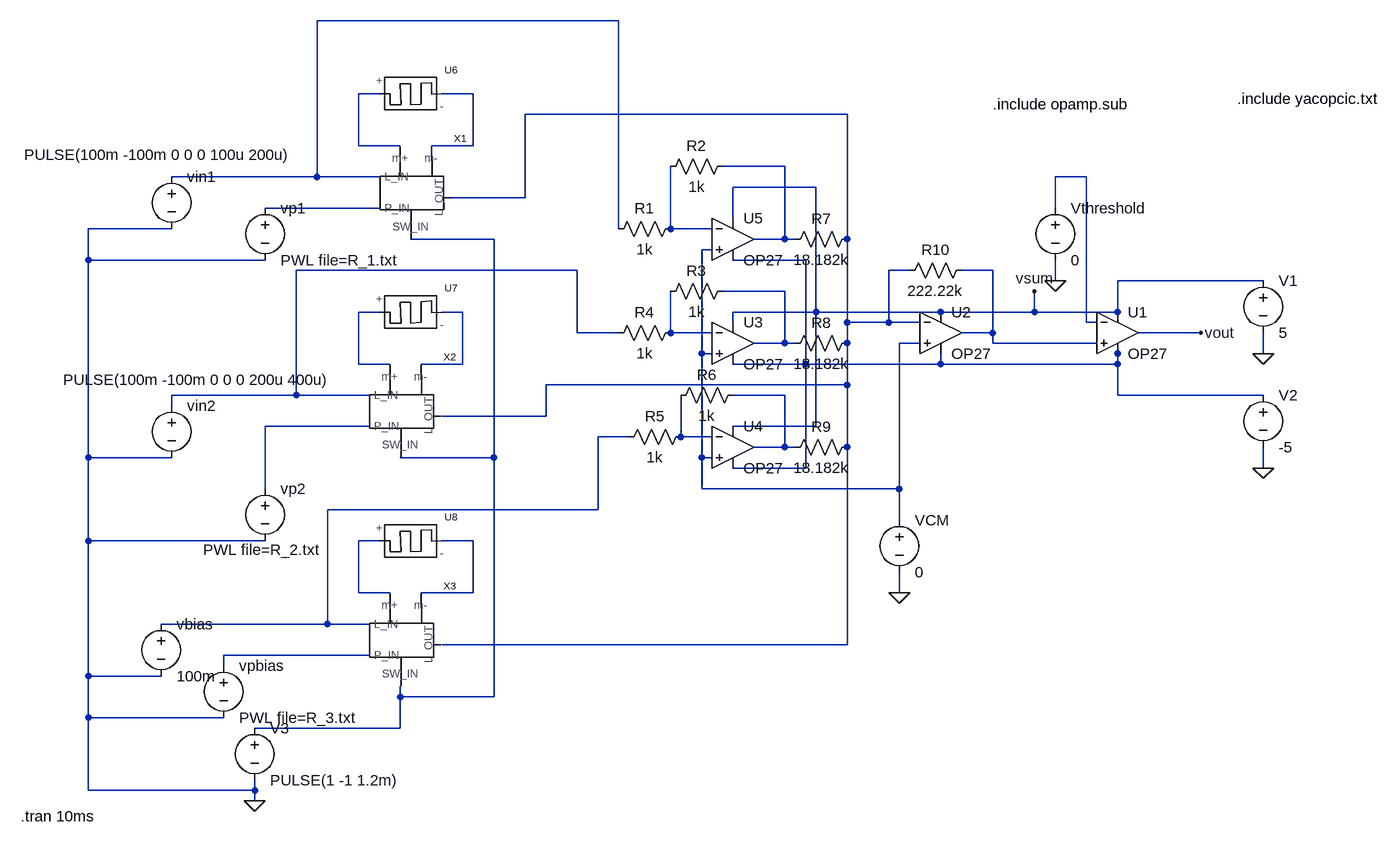
[diagram p0: schematic ADALINE.asc]
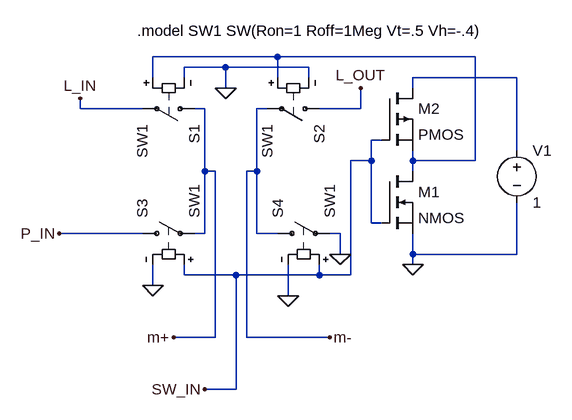
[diagram p1: sub-circuit switchboxsymbol.asc]
ADALINE.asc, the LTspice schematic file:
Version 4
SHEET 1 1164 968
WIRE -80 -272 -544 -272
WIRE -448 -160 -480 -160
WIRE -304 -160 -352 -160
WIRE 272 -128 -224 -128
WIRE -480 -80 -480 -160
WIRE -416 -80 -480 -80
WIRE -304 -80 -304 -160
WIRE -304 -80 -368 -80
WIRE 176 -48 80 -48
WIRE -544 -32 -544 -272
WIRE -544 -32 -768 -32
WIRE -448 -32 -544 -32
WIRE 640 -32 592 -32
WIRE 224 -16 96 -16
WIRE -224 0 -224 -128
WIRE -224 0 -336 0
WIRE -448 16 -624 16
WIRE 592 16 592 -32
WIRE 96 32 96 -16
WIRE -768 48 -896 48
WIRE -80 48 -80 -272
WIRE 0 48 0 -48
WIRE 64 48 0 48
WIRE -272 64 -400 64
WIRE 176 64 176 -48
WIRE 176 64 128 64
WIRE 192 64 176 64
WIRE 272 64 272 -128
WIRE 64 80 48 80
WIRE -896 96 -896 48
WIRE -624 96 -896 96
WIRE 208 96 96 96
WIRE -144 112 -576 112
WIRE 368 112 336 112
WIRE 496 112 448 112
WIRE 592 128 592 96
WIRE 912 128 688 128
WIRE 176 144 80 144
WIRE -448 176 -480 176
WIRE -320 176 -352 176
WIRE 224 176 224 -16
WIRE 224 176 96 176
WIRE 416 176 224 176
WIRE 560 176 560 144
WIRE 560 176 416 176
WIRE 688 176 688 128
WIRE 688 176 560 176
WIRE 96 192 96 176
WIRE 272 192 272 64
WIRE 336 192 336 112
WIRE 336 192 272 192
WIRE 384 192 336 192
WIRE 640 192 640 -32
WIRE 656 192 640 192
WIRE -144 208 -144 112
WIRE -80 208 -144 208
WIRE 0 208 0 144
WIRE 64 208 0 208
WIRE 496 208 496 112
WIRE 496 208 448 208
WIRE 816 208 720 208
WIRE 176 224 176 144
WIRE 176 224 128 224
WIRE 192 224 176 224
WIRE 272 224 272 192
WIRE 384 224 352 224
WIRE 496 224 496 208
WIRE 656 224 496 224
WIRE 48 240 48 80
WIRE 64 240 48 240
WIRE 688 240 688 224
WIRE 912 240 912 208
WIRE -480 256 -480 176
WIRE -432 256 -480 256
WIRE -320 256 -320 176
WIRE -320 256 -384 256
WIRE 208 256 208 96
WIRE 208 256 96 256
WIRE 416 256 416 240
WIRE 416 256 208 256
WIRE 688 256 688 240
WIRE 688 256 416 256
WIRE 272 288 272 224
WIRE 272 288 -192 288
WIRE -576 304 -576 112
WIRE -576 304 -768 304
WIRE -464 304 -576 304
WIRE 176 304 96 304
WIRE 688 304 688 256
WIRE 912 304 688 304
WIRE -768 320 -768 304
WIRE -192 336 -192 288
WIRE -192 336 -352 336
WIRE -464 352 -624 352
WIRE 224 352 224 176
WIRE 224 352 96 352
WIRE -64 368 -112 368
WIRE 16 368 16 304
WIRE 64 368 16 368
WIRE 176 384 176 304
WIRE 176 384 128 384
WIRE 192 384 176 384
WIRE 272 384 272 288
WIRE -896 400 -896 96
WIRE -768 400 -896 400
WIRE -272 400 -272 64
WIRE -272 400 -416 400
WIRE 48 400 48 240
WIRE 64 400 48 400
WIRE 208 416 208 256
WIRE 208 416 96 416
WIRE 912 416 912 384
WIRE -624 448 -624 352
WIRE 48 448 48 400
WIRE 352 448 352 224
WIRE 352 448 48 448
WIRE -112 480 -112 368
WIRE -112 480 -528 480
WIRE 352 496 352 448
WIRE -896 528 -896 400
WIRE -624 528 -896 528
WIRE -448 528 -480 528
WIRE -304 528 -352 528
WIRE -480 608 -480 528
WIRE -432 608 -480 608
WIRE -304 608 -304 528
WIRE -304 608 -384 608
WIRE 352 608 352 576
WIRE -528 656 -528 480
WIRE -528 656 -784 656
WIRE -464 656 -528 656
WIRE 272 688 272 384
WIRE 272 688 -352 688
WIRE -464 704 -688 704
WIRE -688 720 -688 704
WIRE -896 736 -896 528
WIRE -784 736 -896 736
WIRE -416 768 -416 752
WIRE -272 768 -272 400
WIRE -272 768 -416 768
WIRE -896 800 -896 736
WIRE -688 800 -896 800
WIRE -416 816 -416 768
WIRE -416 816 -640 816
WIRE -896 912 -896 800
WIRE -640 912 -640 896
WIRE -640 912 -896 912
WIRE -640 928 -640 912
FLAG 912 416 0
FLAG 912 240 0
FLAG 352 608 0
FLAG -640 928 0
FLAG 816 208 vout
FLAG 560 144 vsum
FLAG 592 128 0
SYMBOL res 16 32 R90
WINDOW 0 0 56 VBottom 2
WINDOW 3 32 56 VTop 2
SYMATTR InstName R1
SYMATTR Value 1k
SYMBOL res 96 -64 R90
WINDOW 0 0 56 VBottom 2
WINDOW 3 32 56 VTop 2
SYMATTR InstName R2
SYMATTR Value 1k
SYMBOL res 96 128 R90
WINDOW 0 0 56 VBottom 2
WINDOW 3 32 56 VTop 2
SYMATTR InstName R3
SYMATTR Value 1k
SYMBOL res 16 192 R90
WINDOW 0 0 56 VBottom 2
WINDOW 3 32 56 VTop 2
SYMATTR InstName R4
SYMATTR Value 1k
SYMBOL res 32 352 R90
WINDOW 0 0 56 VBottom 2
WINDOW 3 32 56 VTop 2
SYMATTR InstName R5
SYMATTR Value 1k
SYMBOL res 112 288 R90
WINDOW 0 0 56 VBottom 2
WINDOW 3 32 56 VTop 2
SYMATTR InstName R6
SYMATTR Value 1k
SYMBOL res 288 48 R90
WINDOW 0 0 56 VBottom 2
WINDOW 3 32 56 VTop 2
SYMATTR InstName R7
SYMATTR Value 18.182k
SYMBOL res 288 208 R90
WINDOW 0 0 56 VBottom 2
WINDOW 3 32 56 VTop 2
SYMATTR InstName R8
SYMATTR Value 18.182k
SYMBOL res 288 368 R90
WINDOW 0 0 56 VBottom 2
WINDOW 3 32 56 VTop 2
SYMATTR InstName R9
SYMATTR Value 18.182k
SYMBOL res 464 96 R90
WINDOW 0 0 56 VBottom 2
WINDOW 3 32 56 VTop 2
SYMATTR InstName R10
SYMATTR Value 222.22k
SYMBOL memristormodel -368 -160 R0
SYMATTR InstName U6
SYMATTR Value MEM_YAKOPCIC
SYMATTR SpiceModel M1
SYMBOL memristormodel -368 176 R0
SYMATTR InstName U7
SYMATTR Value MEM_YAKOPCIC
SYMATTR SpiceModel M2
SYMBOL memristormodel -368 528 R0
SYMATTR InstName U8
SYMATTR Value MEM_YAKOPCIC
SYMATTR SpiceModel M0
SYMBOL voltage 912 112 R0
WINDOW 123 0 0 Left 2
WINDOW 39 0 0 Left 2
SYMATTR InstName V1
SYMATTR Value 5
SYMBOL voltage 912 288 R0
WINDOW 123 0 0 Left 2
WINDOW 39 0 0 Left 2
SYMATTR InstName V2
SYMATTR Value -5
SYMBOL voltage -640 800 R0
WINDOW 123 0 0 Left 2
WINDOW 39 0 0 Left 2
SYMATTR InstName V3
SYMATTR Value PULSE(1 -1 1.2m)
SYMBOL voltage -624 432 R0
WINDOW 123 0 0 Left 2
WINDOW 39 0 0 Left 2
WINDOW 3 -95 110 Left 2
SYMATTR Value PWL file=R_2.txt
SYMATTR InstName vp2
SYMBOL voltage -768 304 R0
WINDOW 3 -167 -24 Left 2
WINDOW 123 0 0 Left 2
WINDOW 39 0 0 Left 2
SYMATTR Value PULSE(100m -100m 0 0 0 200u 400u)
SYMATTR InstName vin2
SYMBOL voltage -624 0 R0
WINDOW 123 0 0 Left 2
WINDOW 39 0 0 Left 2
SYMATTR InstName vp1
SYMATTR Value PWL file=R_1.txt
SYMBOL voltage -768 -48 R0
WINDOW 3 -227 -18 Left 2
WINDOW 123 0 0 Left 2
WINDOW 39 0 0 Left 2
SYMATTR Value PULSE(100m -100m 0 0 0 100u 200u)
SYMATTR InstName vin1
SYMBOL voltage 352 480 R0
WINDOW 123 0 0 Left 2
WINDOW 39 0 0 Left 2
SYMATTR InstName VCM
SYMATTR Value 0
SYMBOL voltage -784 640 R0
WINDOW 123 0 0 Left 2
WINDOW 39 0 0 Left 2
SYMATTR InstName vbias
SYMATTR Value 100m
SYMBOL voltage -688 704 R0
WINDOW 123 0 0 Left 2
WINDOW 39 0 0 Left 2
SYMATTR InstName vpbias
SYMATTR Value PWL file=R_3.txt
SYMBOL voltage 592 0 R0
WINDOW 123 0 0 Left 2
WINDOW 39 0 0 Left 2
SYMATTR InstName Vthreshold
SYMATTR Value 0
SYMBOL Switchboxsymbol -448 0 R0
SYMATTR InstName X1
SYMBOL Switchboxsymbol -464 336 R0
SYMATTR InstName X2
SYMBOL Switchboxsymbol -464 688 R0
SYMATTR InstName X3
SYMBOL Opamps\\OP27 688 144 R0
SYMATTR InstName U1
SYMBOL Opamps\\OP27 416 144 R0
SYMATTR InstName U2
SYMBOL Opamps\\OP27 96 160 R0
SYMATTR InstName U3
SYMBOL Opamps\\OP27 96 320 R0
SYMATTR InstName U4
SYMBOL Opamps\\OP27 96 0 R0
SYMATTR InstName U5
TEXT 872 -152 Left 2 !.include yacopcic.txt
TEXT -1000 952 Left 2 !.tran 10ms
TEXT 496 -144 Left 2 !.include opamp.sub

switchboxsymbol.asc, the sub-circuit schematic file:
Version 4
SHEET 1 880 680
WIRE 160 0 -32 0
WIRE 464 0 160 0
WIRE 80 16 16 16
WIRE 208 16 80 16
WIRE -32 32 -32 0
WIRE 16 32 16 16
WIRE 160 32 160 0
WIRE 208 32 208 16
WIRE 528 32 368 32
WIRE 80 48 80 16
WIRE 368 48 368 32
WIRE -144 80 -144 64
WIRE -48 80 -144 80
WIRE 48 80 32 80
WIRE 144 80 128 80
WIRE 288 80 288 48
WIRE 288 80 224 80
WIRE 320 128 304 128
WIRE 528 144 528 32
WIRE 304 160 304 128
WIRE 304 160 272 160
WIRE 368 160 368 144
WIRE 464 160 464 0
WIRE 464 160 368 160
WIRE 48 176 48 80
WIRE 64 176 48 176
WIRE 128 176 128 80
WIRE 128 176 112 176
WIRE 368 176 368 160
WIRE 304 256 304 160
WIRE 320 256 304 256
WIRE -48 272 -176 272
WIRE 48 272 48 176
WIRE 48 272 32 272
WIRE 128 272 128 176
WIRE 160 272 128 272
WIRE 256 272 240 272
WIRE 256 304 256 272
WIRE 368 304 368 272
WIRE 528 304 528 224
WIRE 528 304 368 304
WIRE 368 320 368 304
WIRE 16 336 16 320
WIRE 96 336 16 336
WIRE 224 336 224 320
WIRE 224 336 96 336
WIRE 272 336 272 160
WIRE 272 336 224 336
WIRE -32 352 -32 320
WIRE 176 368 176 320
WIRE 64 432 64 176
WIRE 64 432 0 432
WIRE 112 432 112 176
WIRE 240 432 112 432
WIRE 96 512 96 336
WIRE 96 512 48 512
FLAG 368 320 0
FLAG -32 352 0
FLAG 176 368 0
FLAG 80 48 0
FLAG -144 64 L_IN
FLAG 288 48 L_OUT
FLAG -176 272 P_IN
FLAG 0 432 m+
FLAG 240 432 m-
FLAG 256 304 0
FLAG 48 512 SW_IN
SYMBOL voltage 528 128 R0
WINDOW 123 0 0 Left 2
WINDOW 39 0 0 Left 2
SYMATTR InstName V1
SYMATTR Value 1
SYMBOL nmos 320 176 R0
SYMATTR InstName M1
SYMBOL pmos 320 48 R0
SYMATTR InstName M2
SYMBOL sw 48 80 R90
SYMATTR InstName S1
SYMATTR Value SW1
SYMBOL sw 240 80 R90
SYMATTR InstName S2
SYMATTR Value SW1
SYMBOL sw -64 272 R270
SYMATTR InstName S3
SYMATTR Value SW1
SYMBOL sw 144 272 R270
SYMATTR InstName S4
SYMATTR Value SW1
TEXT -56 -40 Left 2 !.model SW1 SW(Ron=1 Roff=1Meg Vt=.5 Vh=-.4)

The netlist it stands for:
* ADALINE.asc
R1 N008 N001 1k
R2 N005 N008 1k
R3 N014 N017 1k
R4 N017 N012 1k
R5 N021 N020 1k
R6 N018 N021 1k
R7 N004 N005 18.182k
R8 N004 N014 18.182k
R9 N004 N018 18.182k
R10 N013 N004 222.22k
XU6 N002 N003 M1 MEM_YAKOPCIC  ; pins + -
XU7 N015 N016 M2 MEM_YAKOPCIC  ; pins + -
XU8 N022 N023 M0 MEM_YAKOPCIC  ; pins + -
V1 vsum 0 5
V2 N011 0 -5
V3 N009 0 PULSE(1 -1 1.2m)
vp2 N019 0 PWL file=R_2.txt
vin2 N012 0 PULSE(100m -100m 0 0 0 200u 400u)
vp1 N007 0 PWL file=R_1.txt
vin1 N001 0 PULSE(100m -100m 0 0 0 100u 200u)
VCM N010 0 0
vbias N020 0 100m
vpbias N024 0 PWL file=R_3.txt
Vthreshold N006 0 0
XX1 N001 N007 N004 N002 N003 N009 switchboxsymbol
XX2 N012 N019 N004 N015 N016 N009 switchboxsymbol
XX3 N020 N024 N004 N022 N023 N009 switchboxsymbol
XU1 N013 N006 vsum N011 vout OP27  ; pins In+ In- V+ V- OUT
XU2 N010 N004 vsum N011 N013 OP27  ; pins In+ In- V+ V- OUT
XU3 N010 N017 vsum N011 N014 OP27  ; pins In+ In- V+ V- OUT
XU4 N010 N021 vsum N011 N018 OP27  ; pins In+ In- V+ V- OUT
XU5 N010 N008 vsum N011 N005 OP27  ; pins In+ In- V+ V- OUT

* block symbol definitions
.subckt switchboxsymbol L_IN P_IN L_OUT m+ m- SW_IN
V1 N002 0 1
M1 N001 SW_IN 0 0 NMOS
M2 N002 SW_IN N001 N001 PMOS
S1 m+ L_IN N001 0 SW1
S2 L_OUT m- N001 0 SW1
S3 P_IN m+ SW_IN 0 SW1
S4 m- 0 SW_IN 0 SW1
.model SW1 SW(Ron=1 Roff=1Meg Vt=.5 Vh=-.4)
.ends switchboxsymbol

.model NMOS NMOS
.model PMOS PMOS
.lib standard.mos
.include yacopcic.txt
.tran 10ms
.include opamp.sub
.lib ADI.lib
.backanno
.end